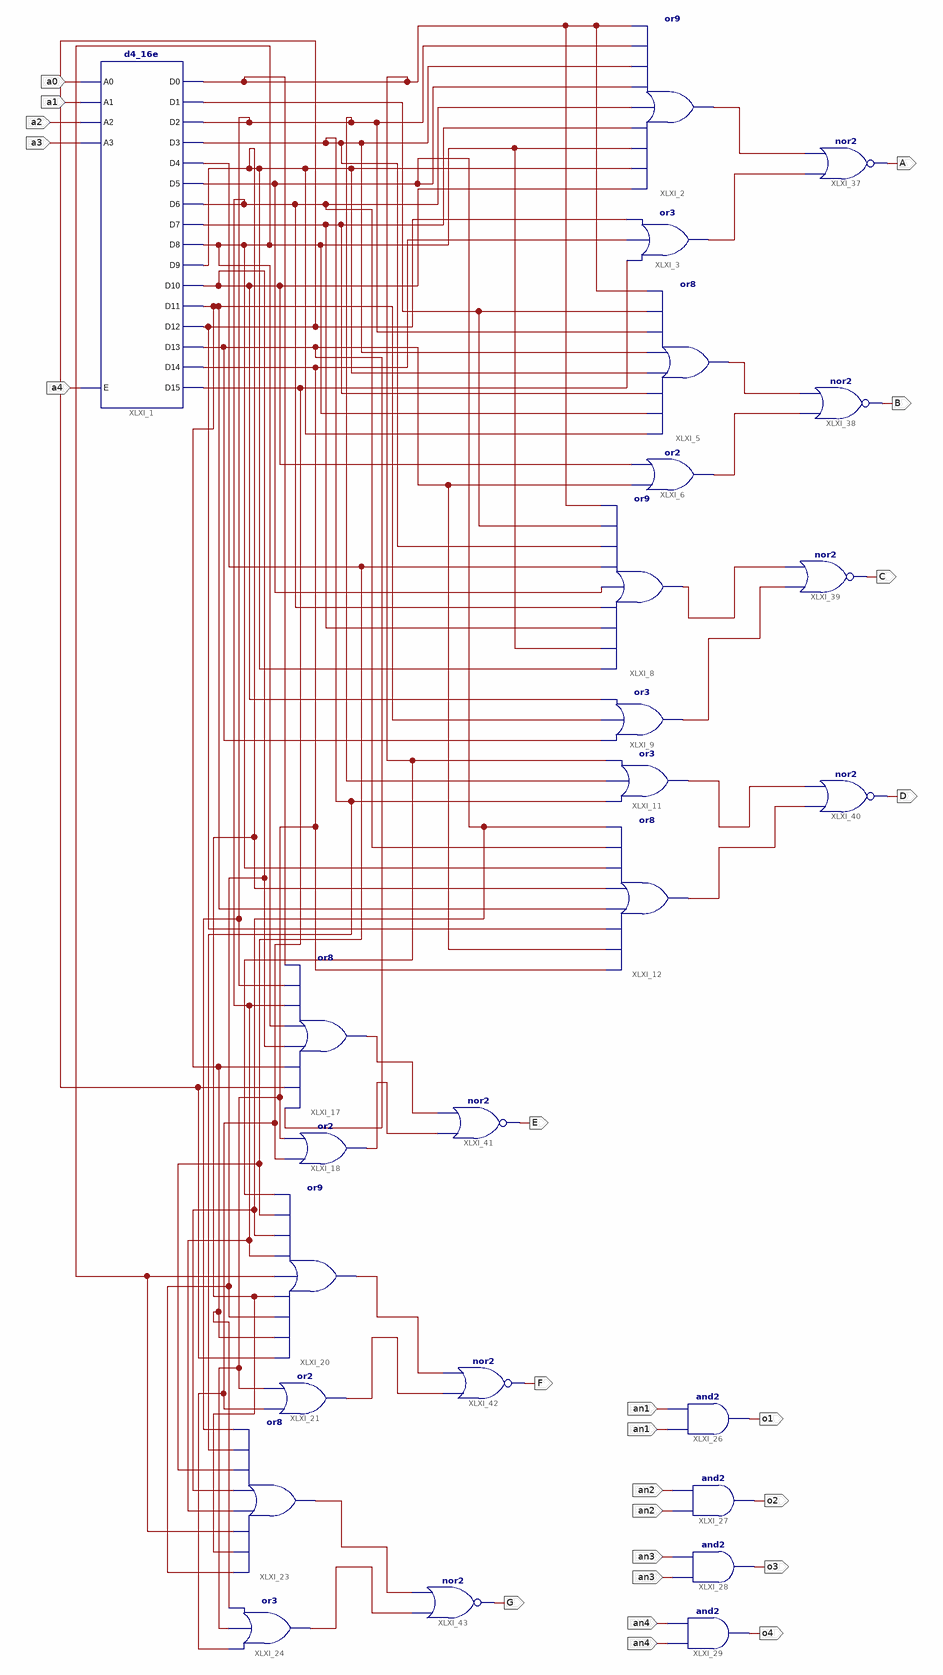
[diagram p0: schematic sheet 1]
// Xilinx ISE schematic Assignment3.sch (spartan6) as structural Verilog: 26 symbols, 20 ports
module Assignment3 (
  input  a0,
  input  a1,
  input  a2,
  input  a3,
  input  a4,
  input  an1,
  input  an2,
  input  an3,
  input  an4,
  output o1,
  output o2,
  output o3,
  output o4,
  output A,
  output B,
  output C,
  output D,
  output E,
  output F,
  output G
);

  wire XLXN_1, XLXN_2, XLXN_17, XLXN_18, XLXN_32, XLXN_34, XLXN_38, XLXN_41, XLXN_46, XLXN_66, XLXN_68,
       XLXN_73, XLXN_75, XLXN_79, XLXN_80, XLXN_82, XLXN_84, XLXN_85, XLXN_86, XLXN_87, XLXN_88, XLXN_89,
       XLXN_90, XLXN_91, XLXN_92, XLXN_125, XLXN_129, XLXN_130, XLXN_131, XLXN_132;

  d4_16e XLXI_1 (
    .A0(a0), .A1(a1), .A2(a2), .A3(a3), .E(a4), .D0(XLXN_75), .D1(XLXN_34), .D10(XLXN_41), .D11(XLXN_79),
    .D12(XLXN_80), .D13(XLXN_68), .D14(XLXN_91), .D15(XLXN_82), .D2(XLXN_84), .D3(XLXN_85), .D4(XLXN_86),
    .D5(XLXN_87), .D6(XLXN_88), .D7(XLXN_38), .D8(XLXN_89), .D9(XLXN_90));
  or XLXI_2 (XLXN_1, XLXN_41, XLXN_90, XLXN_89, XLXN_38, XLXN_88, XLXN_87, XLXN_85, XLXN_84, XLXN_75);
  or XLXI_3 (XLXN_2, XLXN_82, XLXN_91, XLXN_80);
  or XLXI_5 (XLXN_17, XLXN_90, XLXN_89, XLXN_38, XLXN_90, XLXN_85, XLXN_84, XLXN_34, XLXN_75);
  or XLXI_6 (XLXN_18, XLXN_68, XLXN_41);
  or XLXI_8 (XLXN_125, XLXN_90, XLXN_89, XLXN_38, XLXN_88, XLXN_87, XLXN_86, XLXN_85, XLXN_34, XLXN_75);
  or XLXI_9 (XLXN_32, XLXN_68, XLXN_79, XLXN_41);
  or XLXI_11 (XLXN_129, XLXN_85, XLXN_84, XLXN_75);
  or XLXI_12 (XLXN_46, XLXN_91, XLXN_68, XLXN_80, XLXN_79, XLXN_90, XLXN_89, XLXN_88, XLXN_87);
  or XLXI_17 (XLXN_66, XLXN_68, XLXN_80, XLXN_79, XLXN_41, XLXN_89, XLXN_88, XLXN_84, XLXN_75);
  or XLXI_18 (XLXN_130, XLXN_82, XLXN_91);
  or XLXI_20 (XLXN_73, XLXN_80, XLXN_79, XLXN_41, XLXN_90, XLXN_89, XLXN_88, XLXN_87, XLXN_86, XLXN_75);
  or XLXI_21 (XLXN_131, XLXN_82, XLXN_91);
  or XLXI_23 (XLXN_92, XLXN_41, XLXN_90, XLXN_89, XLXN_88, XLXN_87, XLXN_86, XLXN_85, XLXN_84);
  or XLXI_24 (XLXN_132, XLXN_82, XLXN_91, XLXN_79);
  and XLXI_26 (o1, an1, an1);
  and XLXI_27 (o2, an2, an2);
  and XLXI_28 (o3, an3, an3);
  and XLXI_29 (o4, an4, an4);
  nor XLXI_37 (A, XLXN_2, XLXN_1);
  nor XLXI_38 (B, XLXN_18, XLXN_17);
  nor XLXI_39 (C, XLXN_32, XLXN_125);
  nor XLXI_40 (D, XLXN_46, XLXN_129);
  nor XLXI_41 (E, XLXN_130, XLXN_66);
  nor XLXI_42 (F, XLXN_131, XLXN_73);
  nor XLXI_43 (G, XLXN_132, XLXN_92);
endmodule
